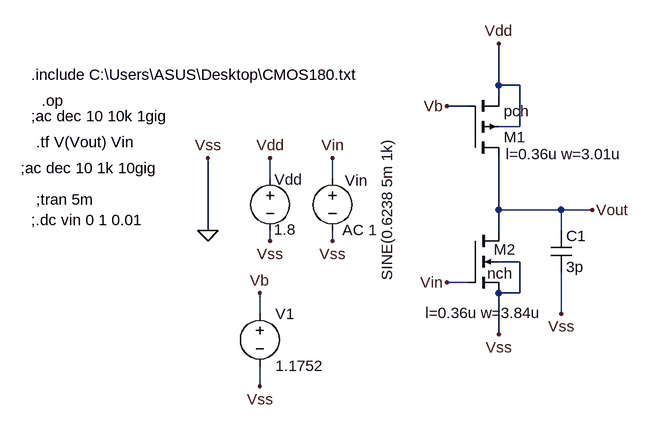
[diagram p0: schematic CS_amp_av=40.asc]
CS_amp_av=40.asc, the LTspice schematic file:
Version 4
SHEET 1 1056 680
WIRE 496 64 496 0
WIRE 528 64 496 64
WIRE 496 80 496 64
WIRE 448 96 416 96
WIRE 528 128 528 64
WIRE 528 128 496 128
WIRE 144 208 144 176
WIRE 240 208 240 176
WIRE 496 256 496 176
WIRE 592 256 496 256
WIRE 640 256 592 256
WIRE 48 288 48 176
WIRE 496 288 496 256
WIRE 592 288 592 256
WIRE 144 304 144 288
WIRE 240 304 240 288
WIRE 528 336 496 336
WIRE 448 368 416 368
WIRE 528 384 528 336
WIRE 528 384 496 384
WIRE 128 416 128 384
WIRE 592 416 592 352
WIRE 496 448 496 384
WIRE 128 528 128 496
FLAG 48 288 0
FLAG 48 176 Vss
FLAG 240 176 Vin
FLAG 144 304 Vss
FLAG 240 304 Vss
FLAG 144 176 Vdd
FLAG 496 0 Vdd
FLAG 416 368 Vin
FLAG 496 448 Vss
FLAG 128 528 Vss
FLAG 128 384 Vb
FLAG 640 256 Vout
FLAG 592 416 Vss
FLAG 416 96 Vb
SYMBOL voltage 144 192 R0
WINDOW 123 0 0 Left 0
WINDOW 39 0 0 Left 0
WINDOW 0 7 17 Left 2
WINDOW 3 6 94 Left 2
SYMATTR InstName Vdd
SYMATTR Value 1.8
SYMBOL voltage 240 192 R0
WINDOW 0 19 19 Left 2
WINDOW 3 84 -46 VRight 2
WINDOW 123 15 95 Left 2
WINDOW 39 0 0 Left 0
SYMATTR InstName Vin
SYMATTR Value SINE(0.6238 5m 1k)
SYMATTR Value2 AC 1
SYMBOL nmos4 448 288 R0
WINDOW 0 40 29 Left 2
WINDOW 3 30 66 Left 2
WINDOW 123 114 127 Right 2
SYMATTR InstName M2
SYMATTR Value nch
SYMATTR Value2 l=0.36u w=3.84u
SYMBOL voltage 128 400 R0
WINDOW 123 0 0 Left 0
WINDOW 39 0 0 Left 0
SYMATTR InstName V1
SYMATTR Value 1.1752
SYMBOL cap 576 288 R0
SYMATTR InstName C1
SYMATTR Value 3p
SYMBOL pmos4 448 176 M180
WINDOW 123 59 6 Left 2
SYMATTR InstName M1
SYMATTR Value pch
SYMATTR Value2 l=0.36u w=3.01u
TEXT -224 48 Left 2 !.include C:\\Users\\ASUS\\Desktop\\CMOS180.txt
TEXT -208 88 Left 2 !.op
TEXT -224 112 Left 2 !;ac dec 10 10k 1gig
TEXT -216 152 Left 2 !.tf V(Vout) Vin
TEXT -240 192 Left 2 !;ac dec 10 1k 10gig
TEXT -224 272 Left 2 !;.dc vin 0 1 0.01
TEXT -216 240 Left 2 !;tran 5m

The netlist it stands for:
* CS_amp_av=40.asc
Vdd Vdd 0 1.8
Vin Vin 0 SINE(0.6238 5m 1k) AC 1
M2 Vout Vin 0 0 nch l=0.36u w=3.84u
V1 Vb 0 1.1752
C1 Vout 0 3p
M1 Vout Vb Vdd Vdd pch l=0.36u w=3.01u
.model NMOS NMOS
.model PMOS PMOS
.lib standard.mos
.include C:\Users\ASUS\Desktop\CMOS180.txt
.op
;ac dec 10 10k 1gig
.tf V(Vout) Vin
;ac dec 10 1k 10gig
;.dc vin 0 1 0.01
;tran 5m
.backanno
.end